# EasyEDA Pro project ProPrj_tang25k_YT8531C_V2.0_2026-08-23.epro, board tang25k
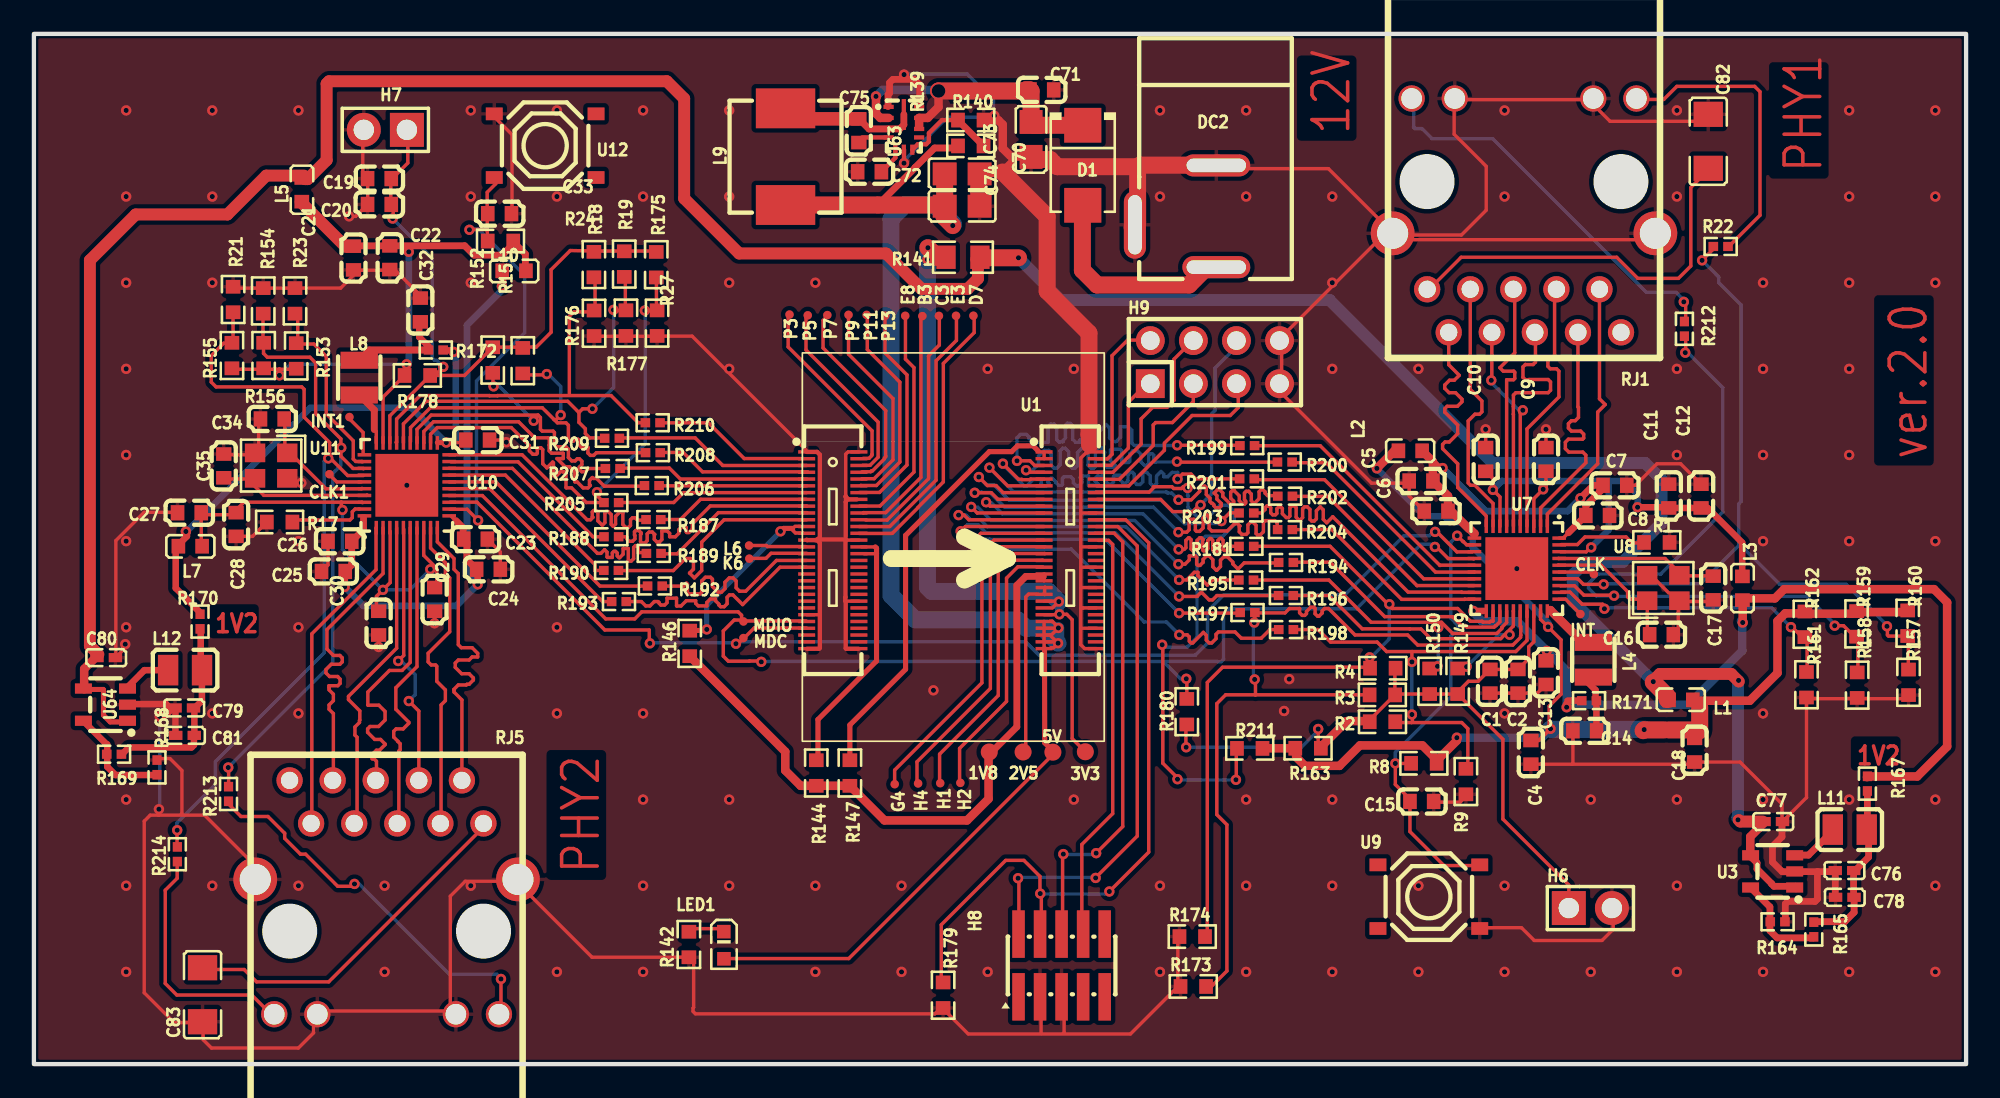
[diagram p8: board, top side]
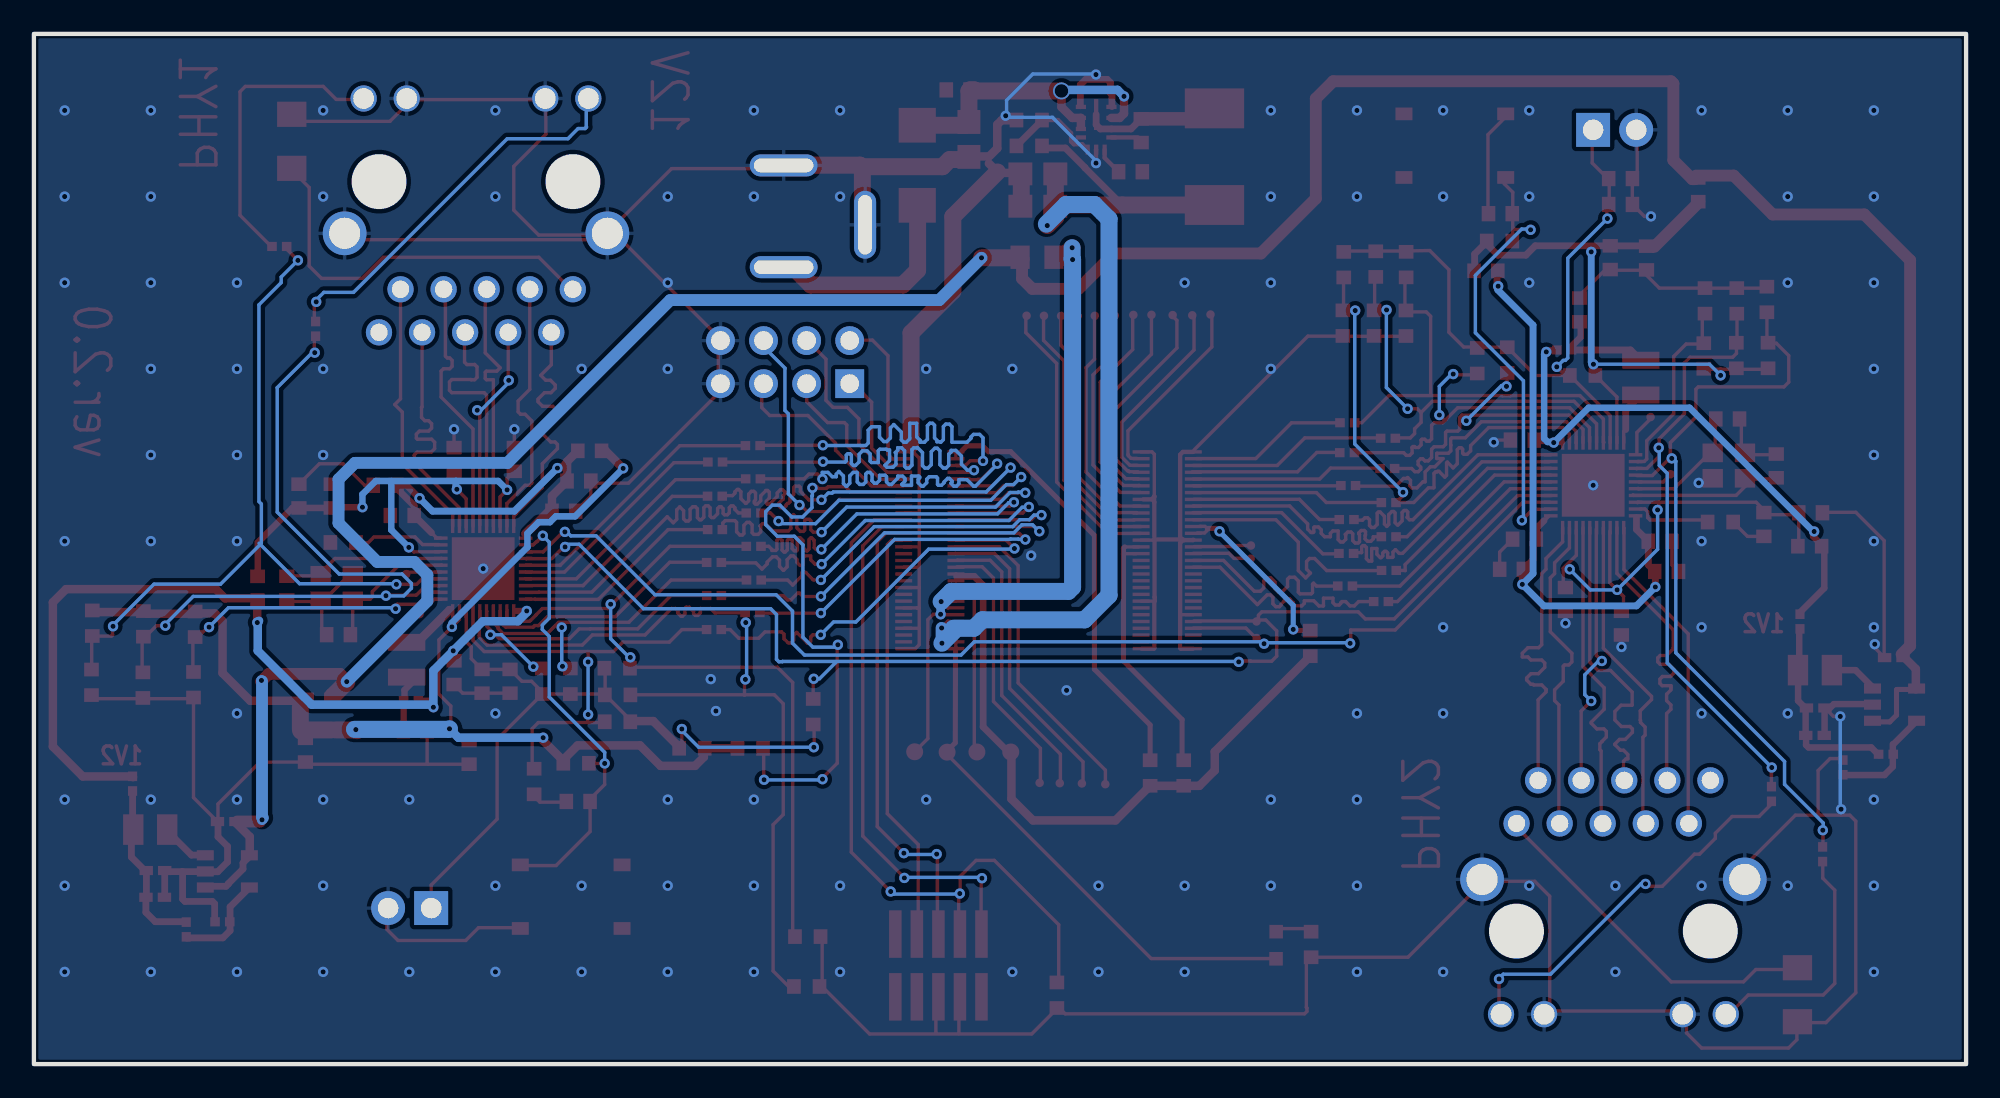
[diagram p9: board, bottom side, seen from below]

Outline 113.93 x 60.75 mm; copper layers: Top Layer, Bottom Layer. Coordinates in mm from the lower left corner of the outline.
Outline path: rectangle 0,60.75 113.93,0
Stack: Top Layer 0.035mm / Dielectric1 1.51mm FR4 er 4.5 / Bottom Layer 0.035mm

## Design rules (mm)
net E1TX0-: DP1
net E1TX0+: DP1
net E2RX3+: DP2
net E2RX3-: DP2
template: Custom Config
spacing copperThickness1oz (default): track to track 0.102, other pairs 0.152 to 0.3
spacing copperThickness2oz: track to track 0.203, other pairs 0.152 to 0.3
track width copperThickness1oz (default): min 0.127, default 0.2, max 2.54
track width copperThickness2oz: min 0.203, default 0.254, max 2.54
differential pair differentialPair (default): width min 0.127, default 0.254, max 2.54; gap min 0.152, default 0.152
via viaSize (default): diameter min 0.5, default 0.61, max 10; hole min 0.3, default 0.305, max 6.3

## Placement (name value [footprint] x y rotation side)
1V8  -  [Test-Point-0.5mm]  56.33 18.4 0 top
2V5  -  [Test-Point-0.5mm]  58.33 18.41 0 top
3V3  -  [Test-Point-0.5mm]  62 18.42 0 top
5V  -  [Test-Point-0.5mm]  60.09 18.39 0 top
B3  -  [Test-Point-0.5mm#2]  52.38 44.11 90 top
C1  1uF  [C0603]  85.86 22.57 90 top
C2  100nF  [C0603]  87.51 22.57 90 top
C3  -  [Test-Point-0.5mm#2]  53.36 44.12 90 top
C4  100nF  [C0603]  88.27 18.38 90 top
C5  1uF  [C0603]  81.79 34.39 0 top
C6  100nF  [C0603]  82.68 32.61 0 top
C7  1uF  [C0603]  93.22 34.13 180 top
C8  100nF  [C0603]  92.21 32.35 180 top
C9  100nF  [C0603]  89.16 35.66 270 top
C10  100nF  [C0603]  85.6 35.66 270 top
C11  100nF  [C0603]  96.4 33.5 270 top
C12  100nF  [C0603]  98.3 33.5 270 top
C13  100nF  [C0603]  89.16 23.08 90 top
C14  10uF  [C0603]  91.45 19.65 180 top
C15  100nF  [C0603]  81.84 15.49 180 top
C16  12pF  [C0603]  95.97 25.32 0 top
C17  12pF  [C0603]  99.02 28.07 270 top
C18  10uF  [C0603]  97.92 18.51 270 top
C19  1uF  [C0603]  20.37 52.22 0 top
C20  100nF  [C0603]  20.37 50.69 0 top
C21  10uF  [C0603]  18.84 47.53 270 top
C22  100nF  [C0603]  20.98 47.55 90 top
C23  1uF  [C0603]  26.04 30.96 180 top
C24  100nF  [C0603]  26.8 29.18 180 top
C25  1uF  [C0603]  17.66 29.05 0 top
C26  100nF  [C0603]  18.04 30.83 0 top
C27  100nF  [C0603]  9.17 32.51 0 top
C28  100nF  [C0603]  11.92 31.82 90 top
C29  100nF  [C0603]  23.63 27.4 90 top
C30  100nF  [C0603]  20.33 26 90 top
C31  100nF  [C0603]  26.17 36.8 180 top
C32  10uF  [C0603]  22.79 44.47 90 top
C33  100nF  [C0603]  27.46 50.15 180 top
C34  12pF  [C0603]  14.06 38.04 180 top
C35  12pF  [C0603]  11.19 35.27 90 top
C70  10uF  [C0805]  58.8 54.53 90 top
C71  220nF  [C0603]  59.43 57.45 0 top
C72  1uF  [C0603]  49.27 52.62 180 top
C73  22uF  [C0805]  54.73 52.49 180 top
C74  22uF  [C0805]  54.73 50.59 180 top
C75  100nF  [C0603]  48.64 55.04 90 top
C76  10uF  [C0402]  106.76 11.41 0 top
C77  4.7uF  [C0402]  102.56 14.3 180 top
C78  6.8pF  [C0402]  106.78 9.84 0 top
C79  10uF  [C0402]  8.87 21 0 top
C80  4.7uF  [C0402]  4.26 23.97 180 top
C81  6.8pF  [C0402]  8.91 19.38 0 top
C82  1nF  [C1206]  98.73 54.42 270 top
C83  1nF  [C1206]  9.94 4.09 90 top
CLK  -  [Test-Point-0.5mm#2]  91.98 28.89 0 top
CLK1  -  [Test-Point-0.5mm#2]  17.42 34.79 0 top
D1  SS56B  [SMB_L4.6-W3.6-LS5.3-RD]  61.85 53 270 top
D7  -  [Test-Point-0.5mm#2]  55.4 44.13 90 top
DC2  DC-005 2.0  [DC-IN-TH_DC-5520-1]  67.32 49.99 270 top
E3  -  [Test-Point-0.5mm#2]  54.37 44.13 90 top
E8  -  [Test-Point-0.5mm#2]  51.38 44.13 90 top
G4  -  [Test-Point-0.5mm#2]  50.76 16.5 0 top
H1  -  [Test-Point-0.5mm#2]  53.44 16.57 0 top
H2  -  [Test-Point-0.5mm#2]  54.63 16.58 0 top
H4  -  [Test-Point-0.5mm#2]  52.14 16.55 0 top
H6  PZ254V-11-02P  [HDR-TH_2P-P2.54-V-M]  91.78 9.2 0 top
H7  PZ254V-11-02P  [HDR-TH_2P-P2.54-V-M]  20.72 55.09 180 top
H8  PZ127VS-12-10-H10-A38  [CONN-SMD_10P-P1.27_XFCN_PZ127VS-12-10-H10-A38]  60.6 5.82 0 top
H9  PZ254V-12-08P-YL  [HDR-TH_8P-P2.54-V-M-R2-C4-S2.54]  69.64 41.4 0 top
INT  -  [Test-Point-0.5mm#2]  91.19 26.54 0 top
INT1  -  [Test-Point-0.5mm#2]  18.6 38.16 0 top
K6  -  [Test-Point-0.5mm#2]  42.19 29.81 0 top
L1  120Ω  [L0603]  97.12 21.48 0 top
L2  120Ω  [L0603]  81.16 36.16 0 top
L3  120Ω  [L0603]  100.74 28.06 270 top
L4  2.2uH  [IND-SMD_L2.5-W2.0_SLW252012P]  91.95 23.84 90 top
L5  120Ω  [L0603]  15.8 51.56 270 top
L6  -  [Test-Point-0.5mm#2]  42.17 30.58 0 top
L7  120Ω  [L0603]  9.22 30.54 180 top
L8  2.2uH  [IND-SMD_L2.5-W2.0_SLW252012P]  19.18 40.48 270 top
L9  1.5uH  [IND-SMD_L7.2-W6.6_GPSR0730]  44.32 53.51 270 top
L10  120Ω  [L0603]  28.31 46.78 180 top
L11  2.2uH  [L0806]  107.07 13.83 0 top
L12  2.2uH  [L0806]  8.91 23.23 0 top
LED1  XL-1608UGC-04  [LED0603-RD_GREEN]  40.68 7.01 270 top
MDC  -  [Test-Point-0.5mm#2]  41.84 25.12 0 top
MDIO  -  [Test-Point-0.5mm#2]  41.84 26.1 0 top
P3  -  [Test-Point-0.5mm#2]  44.55 44.2 0 top
P5  -  [Test-Point-0.5mm#2]  45.63 44.15 0 top
P7  -  [Test-Point-0.5mm#2]  46.78 44.17 0 top
P9  -  [Test-Point-0.5mm#2]  48.03 44.18 0 top
P11  -  [Test-Point-0.5mm#2]  49.1 44.18 90 top
P13  -  [Test-Point-0.5mm#2]  50.2 44.13 0 top
R1  2.49kΩ  [R0603]  95.69 30.76 0 top
R2  10kΩ  [R0603]  79.52 20.19 180 top
R3  10kΩ  [R0603]  79.51 21.77 0 top
R4  10kΩ  [R0603]  79.54 23.34 0 top
R8  4.7kΩ  [R0603]  81.96 17.74 0 top
R9  10kΩ  [R0603]  84.44 16.66 90 top
R17  2.49kΩ  [R0603]  14.49 31.96 180 top
R18  10kΩ  [R0603]  33.02 47.15 90 top
R19  10kΩ  [R0603]  34.81 47.17 90 top
R21  4.7kΩ  [R0603]  11.75 45.09 90 top
R22  330Ω  [R0402]  99.46 48.21 180 top
R23  4.7kΩ  [R0603]  15.39 45.01 90 top
R24  4.7kΩ  [R0603]  27.51 48.53 0 top
R27  10kΩ  [R0603]  36.75 43.69 90 top
R139  100kΩ  [R0603]  55.24 54.15 180 top
R140  24.9kΩ  [R0603]  55.24 55.67 180 top
R141  0Ω  [R0805]  54.78 47.58 0 top
R142  470Ω  [R0603]  38.62 7.05 90 top
R144  0Ω  [R0603]  46.13 17.16 270 top
R146  0Ω  [R0603]  38.67 24.81 90 top
R147  0Ω  [R0603]  48.11 17.16 90 top
R149  4.7kΩ_NO  [R0603]  83.95 22.57 90 top
R150  4.7kΩ_N0  [R0603]  82.3 22.57 90 top
R151  4.7kΩ_NO  [R0603]  28.83 41.48 270 top
R152  4.7kΩ_N0  [R0603]  27.05 41.52 270 top
R153  4.7kΩ  [R0603]  15.47 41.76 90 top
R154  4.7kΩ  [R0603]  13.52 45 90 top
R155  4.7kΩ  [R0603]  11.68 41.78 90 top
R156  4.7kΩ  [R0603]  13.55 41.78 90 top
R157  4.7kΩ  [R0603]  110.54 22.51 270 top
R158  4.7kΩ  [R0603]  107.51 22.35 270 top
R159  4.7kΩ  [R0603]  107.48 25.96 270 top
R160  4.7kΩ  [R0603]  110.49 26 270 top
R161  4.7kΩ  [R0603]  104.52 22.37 270 top
R162  4.7kΩ  [R0603]  104.42 25.93 270 top
R163  4.7kΩ  [R0603]  75.13 18.62 180 top
R164  100kΩ  [R0402]  102.82 8.39 180 top
R165  100kΩ  [R0402]  104.95 7.94 90 top
R167  0Ω  [R0402]  108.11 16.54 90 top
R168  100kΩ  [R0402]  7.26 17.5 270 top
R169  100kΩ  [R0402]  4.73 18.27 0 top
R170  0Ω  [R0402]  9.8 26.1 90 top
R171  0Ω_DNP  [R0402]  91.7 21.43 0 top
R172  0Ω_DNP  [R0402]  23.7 42.11 180 top
R173  10kΩ  [R0603]  68.36 4.58 0 top
R174  10kΩ  [R0603]  68.3 7.52 0 top
R175  10kΩ  [R0603]  36.7 47.14 90 top
R176  10kΩ  [R0603]  33.03 43.69 90 top
R177  10kΩ  [R0603]  34.91 43.69 90 top
R178  4.7kΩ  [R0603]  22.61 40.61 180 top
R179  5.1kΩ  [R0603]  53.61 4.06 270 top
R180  1.5kΩ  [R0603]  67.98 20.78 90 top
R181  22Ω  [R0402]  71.49 30.53 180 top
R187  22Ω  [R0402]  36.53 32.11 0 top
R188  22Ω  [R0402]  34.05 31.1 0 top
R189  22Ω  [R0402]  36.55 30.11 0 top
R190  22Ω  [R0402]  34.03 29.11 0 top
R192  22Ω  [R0402]  36.62 28.19 0 top
R193  22Ω  [R0402]  34.5 27.27 0 top
R194  22Ω  [R0402]  73.83 29.58 180 top
R195  22Ω  [R0402]  71.48 28.54 180 top
R196  22Ω  [R0402]  73.83 27.63 180 top
R197  22Ω  [R0402]  71.56 26.63 180 top
R198  22Ω  [R0402]  73.83 25.62 180 top
R199  0Ω  [R0402]  71.54 36.47 180 top
R200  0Ω  [R0402]  73.76 35.5 180 top
R201  0Ω  [R0402]  71.53 34.51 180 top
R202  0Ω  [R0402]  73.78 33.49 180 top
R203  0Ω  [R0402]  71.5 32.5 180 top
R204  0Ω  [R0402]  73.77 31.52 180 top
R205  0Ω  [R0402]  34.05 33.11 0 top
R206  0Ω  [R0402]  36.43 34.12 0 top
R207  0Ω  [R0402]  34.13 35.12 0 top
R208  0Ω  [R0402]  36.5 36.05 0 top
R209  0Ω  [R0402]  34.09 36.91 0 top
R210  0Ω  [R0402]  36.49 37.82 0 top
R211  10kΩ  [R0603]  71.69 18.62 0 top
R212  330Ω  [R0402]  97.32 43.36 270 top
R213  330Ω  [R0402]  11.47 15.93 90 top
R214  330Ω  [R0402]  8.46 12.37 90 top
RJ1  HY911130A  [RJ45-TH_10P-P2.54-S2.54_L16.1-W21.4_HY911130A]  87.86 50.05 180 top
RJ5  HY911130A  [RJ45-TH_10P-P2.54-S2.54_L16.1-W21.4_HY911130A]  20.8 9.84 0 top
U1  -  [tang25k_som]  59.44 37.54 270 top
U3  TLV62569DBVR  [SOT-23-5_L3.0-W1.7-P0.95-LS2.8-BR]  102.53 11.36 0 top
U7  YT8531C  [QFN-40_L5.0-W5.0-P0.40-BL-EP3.7]  87.44 29.22 180 top
U8  25MHz  [CRYSTAL-SMD_4P-L2.5-W2.0-BL]  96.08 28.07 0 top
U9  TS-1187A-B-A-B  [SW-SMD_4P-L5.1-W5.1-P3.70-LS6.5-TL_H1.5]  82.25 9.87 0 top
U10  YT8531C  [QFN-40_L5.0-W5.0-P0.40-BL-EP3.7]  21.99 34.13 0 top
U11  25MHz  [CRYSTAL-SMD_4P-L2.5-W2.0-BL]  13.99 35.29 180 top
U12  TS-1187A-B-A-B  [SW-SMD_4P-L5.1-W5.1-P3.70-LS6.5-TL_H1.5]  30.15 54.16 180 top
U63  LMR33630CQRNXTQ1  [VQFN-12_L3.0-W2.0-P0.65-BL_TI_RNX]  51.3 55.18 270 top
U64  TLV62569DBVR  [SOT-23-5_L3.0-W1.7-P0.95-LS2.8-BR]  4.22 21.2 0 top

## Footprints (pads in the part's own frame, mm; a bottom-side part is the same pattern mirrored in y, then rotated)
C0402
  rect 0.79x0.54 smd: 1(-0.545,0) 2(0.545,0)
C0603
  rect 0.8x0.9 smd: 1(-0.7,0) 2(0.7,0)
C0805
  rect 1.41x1.35 smd: 1(-1.03,0) 2(1.03,0)
C1206
  rect 1.485x1.728 smd: 1(-1.593,0) 2(1.593,0)
CONN-SMD_10P-P1.27_XFCN_PZ127VS-12-10-H10-A38
  rect 0.74x2.8 smd: 1(-2.54,-1.85) 2(-2.54,1.85) 3(-1.27,-1.85) 4(-1.27,1.85) 5(0,-1.85) 6(0,1.85) 7(1.27,-1.85) 8(1.27,1.85) 9(2.54,-1.85) 10(2.54,1.85)
CRYSTAL-SMD_4P-L2.5-W2.0-BL
  rect 1.2x1.1 smd: 1(-0.95,-0.75) 2(0.95,-0.75) 3(0.95,0.75) 4(-0.95,0.75)
DC-IN-TH_DC-5520-1
  oval 4x1.3 hole 3.5x0.8: 2(0.5,-2.4)
  oval 1.3x4 hole 0.8x3.5: 3(-3,2.4) 4(3,2.4)
HDR-TH_2P-P2.54-V-M
  rect 2x2 hole 1.2: 1(-1.27,0)
  round 2 hole 1.2: 2(1.27,0)
HDR-TH_8P-P2.54-V-M-R2-C4-S2.54
  rect 1.7x1.7 hole 1.1: 1(-3.81,-1.27)
  round 1.7 hole 1.1: 2(-3.81,1.27) 3(-1.27,-1.27) 4(-1.27,1.27) 5(1.27,-1.27) 6(1.27,1.27) 7(3.81,-1.27) 8(3.81,1.27)
IND-SMD_L2.5-W2.0_SLW252012P
  rect 1x2.2 smd: 1(-1.025,0) 2(1.025,0)
IND-SMD_L7.2-W6.6_GPSR0730
  rect 2.35x3.5 smd: 1(-2.85,0) 2(2.85,0)
L0603
  rect 0.8x0.864 smd: 1(-0.7,0) 2(0.7,0)
L0806
  rect 1.2x1.8 smd: 1(-1,0) 2(1,0)
LED0603-RD_GREEN
  rect 0.8x0.8 smd: 1(-0.799,-0.004) 2(0.799,0.004)
QFN-40_L5.0-W5.0-P0.40-BL-EP3.7
  rect 0.2x0.8 smd: 1(-1.8,-2.499) 2(-1.4,-2.499) 3(-1,-2.499) 4(-0.6,-2.499) 5(-0.2,-2.499) 6(0.2,-2.499) 7(0.6,-2.499) 8(1,-2.499) 9(1.4,-2.499) 10(1.8,-2.499) 21(1.8,2.499) 22(1.4,2.499) 23(1,2.499) 24(0.6,2.499) 25(0.2,2.499) 26(-0.2,2.499) 27(-0.6,2.499) 28(-1,2.499) 29(-1.4,2.499) 30(-1.8,2.499)
  rect 0.8x0.2 smd: 11(2.499,-1.8) 12(2.499,-1.4) 13(2.499,-1) 14(2.499,-0.6) 15(2.499,-0.2) 16(2.499,0.2) 17(2.499,0.6) 18(2.499,1) 19(2.499,1.4) 20(2.499,1.8) 31(-2.499,1.8) 32(-2.499,1.4) 33(-2.499,1) 34(-2.499,0.6) 35(-2.499,0.2) 36(-2.499,-0.2) 37(-2.499,-0.6) 38(-2.499,-1) 39(-2.499,-1.4) 40(-2.499,-1.8)
  rect 3.7x3.7 smd: 41(0,0)
R0402
  rect 0.566x0.54 smd: 1(-0.433,0) 2(0.433,0)
R0603
  rect 0.806x0.864 smd: 1(-0.753,0) 2(0.753,0)
R0805
  rect 1.133x1.377 smd: 1(-1,0) 2(1,0)
RJ45-TH_10P-P2.54-S2.54_L16.1-W21.4_HY911130A
  round 1.55 hole 1.016: 1(-5.72,6.895) 2(-4.45,4.355) 3(-3.18,6.895) 4(-1.91,4.355) 5(-0.64,6.895) 6(0.63,4.355) 7(1.9,6.895) 8(3.17,4.355) 9(4.44,6.895) 10(5.71,4.355)
  round 1.55 hole 1.219: 11(-6.625,-6.895) 12(-4.085,-6.895) 13(4.085,-6.895) 14(6.625,-6.895)
  round 2.58 hole 1.829: 15(-7.745,1.055) 16(7.745,1.055)
SMB_L4.6-W3.6-LS5.3-RD
  rect 2.047x2.192 smd: 1(-2.361,0) 2(2.361,0)
SOT-23-5_L3.0-W1.7-P0.95-LS2.8-BR
  rect 1x0.6 smd: 1(1.3,-0.95) 2(1.3,0) 3(1.3,0.95) 4(-1.3,0.95) 5(-1.3,-0.95)
SW-SMD_4P-L5.1-W5.1-P3.70-LS6.5-TL_H1.5
  rect 1x0.75 smd: 1(-3,1.875) 2(3,1.875) 3(-3,-1.875) 4(3,-1.875)
tang25k_som
  rect 0.2x1 smd: J1P1(1.439,-10.796) J1P2(1.439,-13.876) J1P3(1.839,-10.796) J1P4(1.839,-13.876) J1P5(2.239,-10.796) J1P6(2.239,-13.876) J1P7(2.639,-10.796) J1P8(2.639,-13.876) J1P9(3.039,-10.796) J1P10(3.039,-13.876) J1P11(3.439,-10.796) J1P12(3.439,-13.876) J1P13(3.839,-10.796) J1P14(3.839,-13.876) J1P15(4.239,-10.796) J1P16(4.239,-13.876) J1P17(4.639,-10.796) J1P18(4.639,-13.876) J1P19(5.039,-10.796) J1P20(5.039,-13.876) J1P21(5.439,-10.796) J1P22(5.439,-13.876) J1P23(5.839,-10.796) J1P24(5.839,-13.876) J1P25(6.239,-10.796) J1P26(6.239,-13.876) J1P27(6.639,-10.796) J1P28(6.639,-13.876) J1P29(7.039,-10.796) J1P30(7.039,-13.876) J1P31(7.439,-10.796) J1P32(7.439,-13.876) J1P33(7.839,-10.796) J1P34(7.839,-13.876) J1P35(8.239,-10.796) J1P36(8.239,-13.876) J1P37(8.639,-10.796) J1P38(8.639,-13.876) J1P39(9.039,-10.796) J1P40(9.039,-13.876) J1P41(9.439,-10.796) J1P42(9.439,-13.876) J1P43(9.839,-10.796) J1P44(9.839,-13.876) J1P45(10.239,-10.796) J1P46(10.239,-13.876) J1P47(10.639,-10.796) J1P48(10.639,-13.876) J1P49(11.039,-10.796) J1P50(11.039,-13.876) J1P51(11.439,-10.796) J1P52(11.439,-13.876) J1P53(11.839,-10.796) J1P54(11.839,-13.876) J1P55(12.239,-10.796) J1P56(12.239,-13.876) J1P57(12.639,-10.796) J1P58(12.639,-13.876) J1P59(13.039,-10.796) J1P60(13.039,-13.876) J2P1(1.439,3.204) J2P2(1.439,0.124) J2P3(1.839,3.204) J2P4(1.839,0.124) J2P5(2.239,3.204) J2P6(2.239,0.124) J2P7(2.639,3.204) J2P8(2.639,0.124) J2P9(3.039,3.204) J2P10(3.039,0.124) J2P11(3.439,3.204) J2P12(3.439,0.124) J2P13(3.839,3.204) J2P14(3.839,0.124) J2P15(4.239,3.204) J2P16(4.239,0.124) J2P17(4.639,3.204) J2P18(4.639,0.124) J2P19(5.039,3.204) J2P20(5.039,0.124) J2P21(5.439,3.204) J2P22(5.439,0.124) J2P23(5.839,3.204) J2P24(5.839,0.124) J2P25(6.239,3.204) J2P26(6.239,0.124) J2P27(6.639,3.204) J2P28(6.639,0.124) J2P29(7.039,3.204) J2P30(7.039,0.124) J2P31(7.439,3.204) J2P32(7.439,0.124) J2P33(7.839,3.204) J2P34(7.839,0.124) J2P35(8.239,3.204) J2P36(8.239,0.124) J2P37(8.639,3.204) J2P38(8.639,0.124) J2P39(9.039,3.204) J2P40(9.039,0.124) J2P41(9.439,3.204) J2P42(9.439,0.124) J2P43(9.839,3.204) J2P44(9.839,0.124) J2P45(10.239,3.204) J2P46(10.239,0.124) J2P47(10.639,3.204) J2P48(10.639,0.124) J2P49(11.039,3.204) J2P50(11.039,0.124) J2P51(11.439,3.204) J2P52(11.439,0.124) J2P53(11.839,3.204) J2P54(11.839,0.124) J2P55(12.239,3.204) J2P56(12.239,0.124) J2P57(12.639,3.204) J2P58(12.639,0.124) J2P59(13.039,3.204) J2P60(13.039,0.124)
Test-Point-0.5mm
  round 1 smd: 1(0,0)
Test-Point-0.5mm#2
  round 0.5 smd: 1(0,0)
VQFN-12_L3.0-W2.0-P0.65-BL_TI_RNX
  rect 0.25x0.6 smd: 1(-1.262,-0.9) 2(-0.613,-0.9) 3(0.037,-0.9) 4(0.537,-0.9) 8(0.537,0.9) 9(0.037,0.9) 10(-0.613,0.9) 11(-1.262,0.9)
  rect 0.6x0.25 smd: 5(1.262,-0.5) 6(1.262,0) 7(1.262,0.5)
  rect 1.825x0.25 smd: 12(-0.812,0)

## Nets
As in the schematic, except:
GND: C1.1 C2.1 C4.1 C5.1 C6.1 C7.1 C8.1 C9.1 C10.1 C11.1 C12.1 C13.1 C14.2 C15.1 C16.2 C17.2 C18.2 C19.1 C20.1 C21.2 C22.1 C23.1 C24.1 C25.1 C26.1 C27.1 C28.1 C29.1 C30.1 C31.1 C32.2 C33.1 C34.2 C35.2 C70.1 C71.2 C72.2 C73.1 C74.1 C76.1 C77.1 C78.1 C79.1 C80.1 C81.1 C82.1 C83.1 DC2.2 DC2.3 H6.2 H7.2 H8.3 H8.5 H9.7 H9.8 R1.2 R9.1 R17.2 R21.2 R23.2 R27.1 R140.1 R142.1 R154.2 R157.2 R158.2 R161.2 R164.1 R168.1 R173.1 R174.1 R176.1 R177.1 R179.2 RJ1.12 RJ1.13 RJ1.15 RJ1.16 RJ5.12 RJ5.13 RJ5.15 RJ5.16 U1.J1P1 U1.J1P2 U1.J1P15 U1.J1P27 U1.J1P28 U1.J1P45 U1.J1P50 U1.J1P59 U1.J1P60 U1.J2P1 U1.J2P19 U1.J2P29 U1.J2P35 U1.J2P41 U1.J2P47 U1.J2P53 U1.J2P59 U3.2 U7.41 U8.2 U8.4 U9.4 U10.41 U11.2 U11.4 U12.4 U63.1 U63.6 U63.11 U64.2
VCC5: 5V.1 C73.2 C74.2 L9.2 LED1.2 R139.2 U1.J2P52 U1.J2P54 U1.J2P56 U1.J2P58 U1.J2P60
VCC12: C70.2 C71.1 D1.1 U63.2 U63.9 U63.10
VDD_1V8: 1V8.1 R144.2 R146.1 R147.1 U1.J2P38 U1.J2P40
VDD_2V5: 2V5.1 U1.J2P42 U1.J2P44
VDD_3V3: 3V3.1 R141.1 U1.J2P46 U1.J2P48 U1.J2P50
$2I6377\$1N450: C72.1 U63.5
$2I6377\$1N552: D1.2 DC2.4
$2I6377\BOOT: C75.1 U63.4
$2I6377\FEEDBACK: R139.1 R140.2 U63.7
$2I6377\SW: C75.2 L9.1 U63.3 U63.12
$2N8592: R147.2 U1.J2P2 U1.J2P4

Pads without a net: H8 1 7 9 10; RJ1 1; RJ5 1; U1 J1P33 J1P35 J1P37 J1P38 J1P39 J1P40 J1P41 J1P42 J1P43 J1P44 J1P46 J1P47 J1P48 J1P49 J1P51 J1P53 J1P55 J1P56 J1P57 J1P58 J2P17 J2P31 J2P33 J2P37 J2P39 J2P43 J2P45 J2P49 J2P51 J2P55 J2P57; U9 1 3; U12 1 3; U63 8

## Via types
v1: diameter 0.61, hole 0.305, Top Layer to Bottom Layer, 252 vias
v2: diameter 1, hole 0.8, Top Layer to Bottom Layer, 1 via

## Routing (per net, layer and track width the routed paths; a pad name or vN(x,y) marks a point on that pad's centre or on a via; arc(x,y) is an arc through that point)
AVDD33: length 22.5
  Top Layer w0.2: 90.49,31.34 90.17,31.02 U7.40 ; 84.6,31.57 84.65,31.57
  Top Layer w0.4: v1(83.06,35.15) 82.87,35.15 82.49,35.53 ; v1(91.19,33.37) 91.95,34.13 C7.2 92.52,33.94 91.51,32.92 C8.2 90.49,31.34
  Top Layer w0.5: L2.2 82.49,35.53 C5.2 83.38,33.5 C6.2 83.57,32.61 84.6,31.57 ; 84.65,31.57 84.93,31.29 84.94,31.29
  Bottom Layer w0.4: v1(91.19,33.37) 90.43,32.61 85.6,32.61 v1(83.06,35.15)
AVDDL: length 29.9
  Top Layer w0.2: 9.87,32.4 9.84,32.4 9.81,32.43 ; 9.87,32.4 11.75,32.4 ; 9.87,32.4 9.87,30.54 9.96,30.44 ; 21.01,31.42 21.01,28.39 v1(20.58,27.96) 20.2,27.58 20.2,26.7 ; 23.75,28.1 23.75,29.23 22.98,30 22.98,31.46 ; 19.38,33.1 19.35,33.13 18.12,33.13 ; 11.92,32.64 11.92,32.67 12.38,33.13 18.12,33.13 ; 18.12,33.13 18.12,32.62 18.17,32.58 ; 18.12,33.13 18.12,33.15
  Bottom Layer w0.2: 18.19,32.66 18.19,30.35 v1(20.58,27.96) 22.16,27.96 v1(23.37,29.18)
  vias: v1(18.19,32.68)
DVDD33: length 71.8
  Top Layer w0.2: C4.2 88.74,19.08 v1(89.43,19.77) 89.35,19.85 89.35,21.11 90.05,21.81 90.05,25.02 v1(89.28,25.78) 88.84,26.23 U7.29 ; 97.67,21.42 97.84,21.42
  Top Layer w0.5: 82.73,17.93 81.87,18.79 78.19,18.79 76.98,17.59 74.95,17.59 74.43,18.1 74.43,18.51 ; 107.45,26.8 107.22,26.56 104.59,26.56 ; 82.62,17.79 83.9,19.08 v1(83.9,19.25) ; L2.1 80.22,36.16 v1(79.19,35.13) ; 104.48,26.58 103.26,26.58 102.81,26.12 102.81,23.06 101.18,21.42 97.84,21.42 98.22,21.04 ; 110.33,26.67 110.32,26.66 107.58,26.66 ; 74.28,18.62 72.46,18.62
  Top Layer w1: 96.14,19.71 94.93,19.71 94.89,19.66 ; 98.19,19.64 98.13,19.71 96.41,19.71 ; 98.22,21.04 98.22,19.77
  Bottom Layer w0.381: 89.3,25.76 89.3,26.02 84.83,30.48 84.83,31.3 84.17,31.96 83.51,31.96 83.16,32.3 82.01,32.3 v1(79.19,35.13)
  Bottom Layer w0.5: v1(89.43,19.77) 88.9,19.25 v1(83.9,19.25)
  Bottom Layer w1: v1(89.43,19.77) 89.46,19.74 95.03,19.74
  vias: v1(94.95,19.72)
DVDD_RGMII: length 44.8
  Top Layer w0.2: 67.93,18.7 67.93,19.94 67.91,19.96 ; 80.25,21.81 80.25,23.3 80.23,23.31 ; H6.1 90.51,10.56 86.62,14.45 86.62,19.15 R149.1 ; 75.73,19.74 75.73,18.75 75.84,18.63 ; 80.23,21.75 78.84,20.37 ; R149.1 R150.1 80.32,21.82 R3.2 ; R149.1 83.95,21.94 84.59,22.57 85.16,22.57 C1.2 C2.2 88.14,23.91 88.14,24.61 88.44,24.9 U7.28
  Top Layer w0.5: 78.81,20.23 77.41,20.23 75.89,18.71
  Bottom Layer w0.2: v1(67.94,18.68) 74.73,18.68 75.74,19.69
  vias: v1(75.73,19.76)
DVDDL: length 52.6
  Top Layer w0.2: 90.36,21.02 90.36,21.22 90.29,21.29 90.43,21.43
  Top Layer w0.381: R171.1 90.43,21.43 ; v1(84.87,26.72) 85.48,26.72
  Top Layer w0.5: v1(100.76,26.04) 100.76,27.27 100.72,27.31 ; 100.73,27.33 100.86,27.46 102.66,27.46 103.2,28 112.04,28 112.81,27.23 112.81,18.72 111.05,16.96 108.13,16.96 108.09,16.92
  Bottom Layer w0.5: 100.66,26.14 100.73,26.07 100.73,24.38 97.55,21.19 90.53,21.19 v1(90.38,21.04) 90.38,23.2 v1(89.21,24.37) 87.46,26.12 85.39,26.12 84.83,26.68
GND: length 447.2
  Top Layer w0.2: 61.73,25.67 61.73,24.73 61.96,24.5 U1.J2P59 ; 61.73,25.67 61.75,25.7 U1.J2P53 ; 61.73,25.67 61.73,26.89 ; 67.54,4.65 67.58,4.61 67.58,4.64 ; 60.71,1.83 60.75,1.86 60.75,4 ; 18.9,46.81 20.84,46.81 ; 4.83,23.99 4.83,30.87 6.5,32.54 8.29,32.54 ; 4.83,23.99 C80.1 ; 4.83,23.99 5.39,24.55 v1(5.39,24.76) ; U1.J2P35 61.74,29.3 61.73,29.29 ; R161.2 104.52,15.71 C77.1 103.08,14.33 103.08,15.33 100.6,17.81 C18.2 97.8,17.68 90.69,17.68 ; 80.07,48.61 95.23,48.61 95.56,48.94 ; 79.76,48.7 79.39,48.7 73.37,42.68 ; C29.1 23.63,26 v1(23.62,25.99) ; 83.79,56.88 91.85,56.88 91.97,57 ; v1(85.6,37.43) C10.1 ; R23.2 18.09,45.76 18.9,46.58 18.9,46.78 C21.2 ; v1(7.42,20.5) 7.82,20.5 C79.1 ; 67.45,7.48 67.45,4.74 ; 12.86,35.87 13.25,36.26 13.25,38 ; 80.18,48.95 76.33,52.8 69.82,52.8 ; 16.96,29.05 17.34,29.43 C26.1 ; 13.03,11.06 13.03,11.72 10.06,14.68 7.36,14.68 ; 16.49,2.71 16.49,1.84 15.59,0.95 10.47,0.95 9.98,1.44 9.98,2.43 ; 19.68,52.22 19.68,52.19 ; 19.68,52.19 19.8,52.07 ; 19.68,52.19 19.68,50.77 ; 27.82,36.67 27.69,36.8 C31.1 ; C30.1 20.33,24.6 v1(20.32,24.6) ; C6.1 81.09,33.5 C5.1 80.97,34.26 78.87,34.26 73.45,39.68 H9.7 ; 61.73,28.08 61.75,28.1 U1.J2P41 ; 61.73,28.08 61.73,29.29 ; 61.73,28.08 61.73,26.89 ; 96.96,27.28 96.96,27.29 ; 96.96,27.28 98.94,27.28 98.99,27.33 ; 96.96,27.28 96.94,27.28 ; 96.96,27.28 96.96,25.6 96.64,25.29 ; 47.87,35.96 47.87,33.48 ; C23.1 27.5,30.19 C24.1 ; U1.J1P50 46.32,26.5 46.34,26.53 ; 107.68,21.55 110.64,21.55 110.72,21.63 ; 107.68,21.55 107.69,21.56 ; 107.68,21.55 104.67,21.55 ; U8.4 95.36,28.82 96.4,27.78 ; 62.36,36.29 62.12,36.05 62.04,36.05 61.73,35.74 61.73,32.5 ; 83.75,56.82 83.75,54.83 85.63,52.94 85.63,50.35 84.17,48.89 79.84,48.89 ; 73.57,40.21 73.57,42.78 ; 36.91,42.93 38.81,42.93 45.51,36.23 ; 89.16,22.38 88.65,21.87 C2.1 C1.1 ; 24.55,3.27 24.55,9.9 25.43,10.78 27.9,10.78 ; 73.39,40.21 73.45,40.21 ; 90.69,17.68 90.75,17.74 C14.2 ; 90.69,17.68 C4.1 ; 59.39,3.9 59.39,1.81 59.4,1.79 ; R17.2 12.89,31.12 C28.1 ; 61.73,29.29 61.73,30.48 ; 11.14,35.93 12.8,35.93 ; 61.73,30.48 61.73,32.5 ; 61.73,30.48 61.75,30.5 U1.J2P29 ; 28.57,10.64 32.91,6.3 38.51,6.3 ; 19.66,52.21 19.39,52.48 19.39,55.1 ; 61.73,26.89 61.85,26.89 61.86,26.9 U1.J2P47 ; 27.13,55.88 28.19,54.81 28.19,50.12 ; 96.4,30.79 96.39,30.78 ; 22.84,45.27 21.31,46.81 21,46.81 ; 53.7,3.17 55.09,1.78 64.66,1.78 67.49,4.61 ; 47.87,27.29 47.88,27.3 U1.J1P45 ; 19.72,50.74 19.82,50.64 ; 7.36,14.68 7.37,14.69 v1(7.37,15.03) ; 7.36,14.68 6.86,14.68 6.5,14.33 6.5,4.21 8.27,2.44 9.71,2.44 ; 47.86,35.96 48,36.1 U1.J1P1 ; 84.41,15.76 84.1,15.44 82.58,15.44 ; 61.73,32.5 61.73,32.5 U1.J2P19 ; 8.68,14.73 8.72,14.77 8.72,17.31 8.02,18.02 7.34,18.02 ; C7.1 94.43,34.13 95.7,35.4 97.1,35.4 C12.1 ; 16.8,3.13 24.48,3.13 24.66,2.95 ; 11.71,45.75 15.31,45.75 15.35,45.72 ; 36.72,43.11 36.53,42.92 33.02,42.92 ; C20.1 18.97,49.99 v1(18.58,49.99) ; U1.J1P27 47.89,30.9 ; 38.9,6.27 38.9,3.34 38.87,3.31 38.87,3.11 39.01,2.96 53.12,2.96 53.36,3.21 ; 91.9,56.93 91.9,56.63 92.94,55.59 98.16,55.59 98.45,55.89 ; 85.32,8.04 87.71,8.04 88.47,7.29 92.46,7.29 93.12,7.95 93.12,9.1 ; 96.43,31.01 96.43,30.75 ; C9.1 v1(89.16,37.43)
  Top Layer w0.254: 47.88,33.45 48.03,33.3 48.52,33.3 ; 47.88,33.45 47.87,33.46 47.87,33.48 47.88,33.45 ; 47.88,33.45 47.88,33.15 47.87,33.14 47.87,31.11 ; 45.59,24.49 46.3,24.49 46.34,24.54 46.34,30.74 46.18,30.9 ; 45.57,30.92 45.59,30.9 46.09,30.9 ; 46.09,30.9 46.18,30.9 ; 46.09,30.9 46.22,30.94 ; 46.18,30.9 46.22,30.94 ; U63.6 51.31,53.91 v1(51.31,53.13) ; 46.22,30.94 47.88,30.94 47.88,30.92 ; 46.22,30.94 46.34,31.06 46.34,35.94 46.18,36.1 45.59,36.1 45.57,36.12 ; 47.88,30.92 47.85,30.89 47.85,27.53 47.84,27.52 47.84,27.31 47.87,27.29 47.87,24.52 47.9,24.49 48.62,24.49 ; 47.88,30.92 47.9,30.89 ; 96.39,31.05 96.43,31.01
  Top Layer w0.381: 5.51,21.23 5.89,21.23 5.9,21.23 7.8,21.23 8.05,20.97 ; 8.34,20.9 8.34,19.48
  Top Layer w0.4: 105.18,11.35 105.16,11.33 105.16,9.73 105.02,9.59 103.41,9.59 103.27,9.45 103.27,8.37 ; 105.18,11.35 106.04,11.35 106.14,11.44 ; 105.18,11.35 103.85,11.35 ; 103.82,11.34 103.09,11.34 102.51,11.92 102.51,12.84 103.08,13.4 103.08,14.23 ; 50.36,56.47 50.36,57.17 50.45,57.26 50.45,57.88 50.64,58.07 51.91,58.07 52.23,57.75 52.23,56.51 ; 106.21,9.84 106.22,9.84 106.22,11.41
  Top Layer w0.5: 57.62,53.52 58.7,53.52 ; 57.56,53.57 57.13,54 57.13,55.4 56.87,55.66 56.04,55.66 ; 57.12,52.61 57.62,53.11 ; 55.77,52.55 57,52.55
  Top Layer w1: 69.75,53.14 69.62,53.01 65.22,53.01 65.13,52.92 ; 65.13,52.92 65.08,52.87 65.08,49.66 64.76,49.34 ; 65.13,52.92 60.35,52.92 59.93,53.34 58.81,53.34 ; 55.71,50.63 55.71,52.52 ; 57.12,52.61 59.75,49.98 59.75,45.58 62.21,43.11 62.21,37.1 62.24,37.07 62.24,36.52
  Bottom Layer w0.2: 56.72,55.83 53.87,55.83 51.17,53.14 ; 51.31,58.38 55.03,58.38 56.58,56.84 56.58,56.09 56.62,56.04 ; v1(7.37,15.03) 7.42,15.08 v1(7.42,20.5)
  vias: v1(5.44,56.24) v1(5.44,51.16) v1(5.44,46.08) v1(5.44,41) v1(5.44,35.92) v1(5.44,30.84) v1(5.44,25.76) v1(5.44,15.6) v1(5.44,10.52) v1(5.44,5.44) v1(10.52,56.24) v1(10.52,51.16) v1(10.52,46.08) v1(10.52,20.68) v1(10.52,10.52) v1(15.6,56.24) v1(15.6,30.84) v1(15.6,25.76) v1(15.6,20.68) v1(15.6,10.52) v1(15.77,34.27) v1(20.68,10.52) v1(20.68,5.44) v1(21.99,34.13) v1(25.76,56.24) v1(25.76,51.16) v1(25.76,46.08) v1(25.76,10.52) v1(27.85,36.67) v1(30.84,56.24) v1(30.84,51.16) v1(30.84,25.76) v1(30.84,20.68) v1(30.84,5.44) v1(35.92,56.24) v1(35.92,51.16) v1(35.92,20.68) v1(35.92,15.6) v1(35.92,10.52) v1(35.92,5.44) v1(41,56.24) v1(41,51.16) v1(41,46.08) v1(41,41) v1(41,15.6) v1(41,10.52) v1(46.08,46.08) v1(46.08,10.52) v1(46.08,5.44) v1(51.16,10.52) v1(51.16,5.44) v1(51.31,58.35) v1(53.04,22.04) v1(55.13,29.99) v1(56.24,41) v1(56.24,5.44) v1(56.63,55.92) v1(61.32,41) v1(61.32,15.6) v1(66.4,56.24) v1(66.4,51.16) v1(66.4,10.52) v1(66.4,5.44) v1(71.48,56.24) v1(71.48,51.16) v1(71.48,15.6) v1(71.48,10.52) v1(71.48,5.44) v1(73.72,20.82) v1(74.02,22.7) v1(76.56,51.16) v1(76.56,46.08) v1(76.56,41) v1(76.56,15.6) v1(76.56,10.52) v1(76.56,5.44) v1(81.64,41) v1(81.64,10.52) v1(81.64,5.44) v1(86.72,56.24) v1(86.72,51.16) v1(86.72,20.68) v1(86.72,10.52) v1(86.72,5.44) v1(87.44,29.22) v1(91.8,15.6) v1(91.8,5.44) v1(96.88,56.24) v1(96.88,51.16) v1(96.88,41) v1(96.88,35.92) v1(96.88,15.6) v1(96.88,10.52) v1(96.88,5.44) v1(101.96,46.08) v1(101.96,41) v1(101.96,35.92) v1(101.96,30.84) v1(101.96,20.68) v1(101.96,15.6) v1(101.96,5.44) v1(107.04,56.24) v1(107.04,51.16) v1(107.04,46.08) v1(107.04,41) v1(107.04,35.92) v1(107.04,30.84) v1(107.04,15.6) v1(107.04,5.44) v1(112.12,56.24) v1(112.12,51.16) v1(112.12,46.08) v1(112.12,30.84) v1(112.12,15.6) v1(112.12,10.52) v1(112.12,5.44)
VCC5: length 94
  Top Layer w0.2: 59.97,24.55 60.12,24.55 v1(60.39,24.82) 60.31,24.9 ; U1.J2P56 U1.J2P54 ; U1.J2P56 U1.J2P58 ; U1.J2P56 59.91,25.3 ; U1.J2P54 60.39,25.7 ; U1.J2P54 U1.J2P52 ; 60.25,18.42 48.05,6.22 40.76,6.22 ; 59.92,26.11 60.05,26.11 60.36,25.8 ; U1.J2P58 U1.J2P60 ; U1.J2P58 60.31,24.9 ; 60.31,24.9 59.91,25.3 ; 59.91,25.3 59.99,25.3 60.39,25.7 ; 60.39,25.7 v1(60.41,25.72)
  Top Layer w0.3: 59.59,24.5 59.6,18.94 60.07,18.48
  Top Layer w0.4: R139.2 54.36,54.02 53.11,54.02 51.96,52.88 51.96,52.86 49.76,50.66
  Top Layer w1: 53.67,50.55 53.67,49.95 v1(54.18,49.45) ; 53.63,50.66 L9.2 ; C74.2 C73.2
  Bottom Layer w0.7: v1(60.39,24.82) 60.41,24.84 v1(60.41,25.72)
  Bottom Layer w1: v1(60.39,24.82) 59.71,25.5 ; 59.71,25.7 58.51,25.7 58.01,26.2 51.98,26.2 50.54,27.64 50.54,49.83 51.4,50.69 53.07,50.69 54.23,49.53
VCC12: length 19.1
  Top Layer w0.5: U63.2 49.91,55.8 49.65,56.05 v1(49.65,57.07) ; 52.2,55.29 U63.10 52.7,55.8 53.34,56.44 v2(53.34,57.39)
  Top Layer w1: D1.1 58.99,55.36 58.8,55.56 58.8,57.38 C71.1 58.48,57.45 58.42,57.39 v2(53.34,57.39)
  Bottom Layer w0.5: v2(53.34,57.39) 53.28,57.45 50.03,57.45 v1(49.65,57.07)
VDD_1V8: length 38
  Top Layer w0.2: 59.56,28.9 59.57,28.91 ; 59.56,28.49 59.56,28.72
  Top Layer w0.4: 59.52,28.76 58.49,28.76 57.96,28.23 57.96,19.88 56.5,18.42
  Top Layer w0.5: R146.1 44.3,18.42 44.3,17.32 45.21,16.41 R144.2 R147.1 50.15,14.37 55.02,14.37 56.29,15.64 56.29,18.36 1V8.1
VDD_2V5: length 10.4
  Top Layer w0.2: 58.28,18.44 58.28,18.53 58.48,18.73 58.48,27.55 58.65,27.72 59.17,27.72 ; 59.59,27.68 59.59,28.1 59.62,28.13
VDD_3V3: length 41.5
  Top Layer w0.2: 60.06,26.9 v1(60.44,27.27) 60.41,27.3 U1.J2P46 ; 3V3.1 61.22,19.2 61.22,26.21 60.9,26.52 v1(60.47,26.52) 60.44,26.5 U1.J2P50
  Top Layer w1: v1(52.71,48.14) 53.27,47.58 R141.1
  Bottom Layer w0.5: 60.47,27.24 v1(60.47,26.52)
  Bottom Layer w1: v1(60.44,27.27) 59.84,27.87 52.94,27.87 52.69,28.13 v1(52.69,47.44) 52.71,47.47 v1(52.71,48.14)
$2I6377\$1N450: length 1.6
  Top Layer w0.254: U63.5 50.8,53.44 C72.1
$2I6377\$1N552: length 12.2
  Top Layer w1: 69.48,46.86 69.03,46.86 68.11,45.94 62.69,45.94 61.82,46.81 61.82,50.62
$2I6377\BOOT: length 1.6
  Top Layer w0.254: U63.4 48.84,54.64
$2I6377\FEEDBACK: length 5.9
  Top Layer w0.254: R140.2 53.55,55.67 52.78,54.9 52.78,54.4 52.61,54.24 52.12,54.24 U63.7
  Top Layer w0.4: R139.1 54.49,55.65 R140.2
$2I6377\SW: length 8.2
  Top Layer w0.4: U63.12 51.3,55.39 51.05,55.14 U63.3 49.24,55.14 C75.2
  Top Layer w0.8: L9.1 44.94,55.74 C75.2
CFG_EXT: length 17.2
  Top Layer w0.2: 90.04,27.83 90.58,27.83 91.3,27.12 92.5,27.12 92.5,27.08 92.64,26.94 ; 104.56,25.05 104.56,23.43 104.62,23.36 ; 104.35,25.1 103.68,25.77 v1(103.6,25.77)
  Bottom Layer w0.2: 92.6,26.91 102.46,26.91 v1(103.6,25.77)
  vias: v1(92.6,26.85)
CFG_LDO0: length 43.5
  Top Layer w0.2: 107.4,25.16 106.71,25.85 v1(106.18,25.85) ; 93.21,27.65 91.39,27.65 90.83,28.21 90.03,28.21 90.02,28.2 ; 97.42,42.03 97.4,42.05 97.4,42.82 ; 107.55,25.13 107.55,23.28 107.66,23.17
  Bottom Layer w0.2: 106.24,25.88 104.54,27.58 93.21,27.58 ; 93.15,27.56 93.09,27.61 92.13,27.61 91.67,28.06 91.67,28.35 92.22,28.9 95.93,28.9 99.59,32.56 99.59,39.89 97.5,41.98 97.4,41.98
  vias: v1(93.17,27.62) v1(97.37,41.95)
CFG_LDO1: length 44.6
  Top Layer w0.2: v1(92.56,28.29) 91.37,28.29 91.03,28.62 90.01,28.62 ; 98.37,47.4 99,48.03 99,48.2 ; 110.34,25.34 110.24,25.24 109.36,25.24 109.29,25.3 109.29,25.78 ; 110.53,25.14 110.53,23.46 110.57,23.41
  Bottom Layer w0.2: 92.62,28.33 98.27,28.33 100.58,30.64 ; v1(98.37,47.4) 99.35,46.41 99.35,46.08 100.66,44.77 100.66,33.17 100.52,33.03 100.52,30.71 100.58,30.64 ; 109.31,25.84 106.85,28.3 102.92,28.3 100.58,30.64 ; 100.58,30.64 100.65,30.71
  vias: v1(109.27,25.82)
E1_AVDDL: length 32.7
  Top Layer w0.2: C9.2 89.16,34.06 v1(88.99,33.89) 88.44,33.34 88.44,31.66 ; C10.2 86.03,34.53 v1(86.03,33.86) 86.45,33.44 86.45,31.7 ; 90.04,30.21 91.53,30.21 91.78,30.46
  Top Layer w0.381: 100.72,28.86 100.73,28.87 100.73,30.75 98.68,32.8 C12.2 C11.2 96.36,32.84 v1(94.56,32.84)
  Bottom Layer w0.381: 91.8,30.45 92.86,31.5 92.86,34.39 86.55,34.39 v1(86.03,33.86) ; 92.86,34.27 92.97,34.39 93.78,34.39 94.56,33.6 v1(94.56,32.84)
  Bottom Layer w0.4: v1(88.99,33.89) 89.05,33.95 89.05,34.39
  vias: v1(91.82,30.47)
E1RX1+: length 15.5
  Top Layer w0.2: U7.4 88.04,37.46 89.92,39.34 89.92,40.86 89.78,41 89.41,41 89.27,41.14 89.27,41.5 89.41,41.64 89.56,41.64 89.67,41.75 89.67,45.58 RJ1.4
E1RX1-: length 12.3
  Top Layer w0.2: 87.64,31.79 87.64,38.41 v1(87.79,38.56) ; v1(85.93,40.32) 85.96,40.35 RJ1.7
  Bottom Layer w0.2: v1(85.93,40.32) 85.93,40.19 87.57,38.56 v1(87.79,38.56)
E1RX3+: length 15.5
  Top Layer w0.2: RJ1.8 84.69,39.79 85.38,39.1 85.38,38.46 85.24,38.32 84.97,38.32 84.57,37.93 84.57,34.27 84.71,34.13 84.97,34.13 86.04,33.06 U7.9
E1RX3-: length 15.5
  Top Layer w0.2: RJ1.9 83.42,41.24 84.05,40.62 83.76,40.33 83.47,40.33 83.19,40.05 83.19,39.85 83.44,39.59 83.83,39.59 84.21,39.21 84.21,39.06 83.94,38.79 83.33,38.79 83.19,38.65 83.19,38.45 83.95,37.69 83.95,37.18 83.46,36.69 83.2,36.69 83.06,36.54 83.06,36.29 83.95,35.4 83.95,34 85.64,32.32 U7.10
E1TX0+: length 15.5
  Top Layer w0.2: U7.1 89.24,32.43 92.21,35.4 92.21,38.45 92.65,38.89 92.31,39.23 RJ1.2
E1TX0-: length 15.5
  Top Layer w0.2: U7.2 88.84,32.8 91.51,35.46 91.51,35.91 91.33,36.09 90.5,36.09 90.3,36.29 90.3,36.67 90.48,36.85 91.32,36.85 91.38,36.91 91.38,37.15 91.2,37.33 90.66,37.33 90.48,37.5 90.48,37.76 90.66,37.94 90.88,37.94 91.08,38.13 91.08,38.72 91.04,38.75 RJ1.3
E1TX2+: length 15.5
  Top Layer w0.2: RJ1.5 88.54,43.12 88.54,41.39 88.4,41.25 87.95,41.25 87.94,41.26 87.8,41.12 87.8,40.5 87.94,40.35 88.14,40.35 88.16,40.37 89.29,40.37 89.43,40.23 89.43,39.73 89.29,39.59 87.38,39.59 87.24,39.45 87.24,38.79 87.24,38.79 87.24,38.33 87.24,38.32 U7.6
E1TX2-: length 15.5
  Top Layer w0.2: U7.7 86.84,40.35 87.24,40.35 87.32,40.43 87.32,40.8 87.25,40.86 86.64,40.86 86.44,41.06 87.32,41.94 87.32,45.61 RJ1.6
E2_AVDD33: length 37.7
  Top Layer w0.2: 24.89,32.04 24.87,32.04 24.61,32.3 ; 27.48,45.86 27.66,46.03
  Top Layer w0.4: C23.2 25.53,30.76 25.53,29.75 C24.2 ; 24.89,32.04 25.31,31.62 25.31,30.99 ; 19.44,32.23 19.44,31.53 C26.2 18.74,29.43 C25.2 18.32,29.02 v1(18.32,28.14) ; 27.66,46.03 27.66,46.84 ; 26.17,29.11 v1(26.17,28.29)
  Bottom Layer w0.4: v1(18.32,28.14) 19.44,27.02 24.9,27.02 v1(26.17,28.29) 25.53,28.92 25.53,43.58 27.61,45.65 27.61,45.9
  vias: v1(27.59,45.87)
E2_DVDD33: length 38.6
  Top Layer w0.2: R178.2 20.59,39.34 U10.29 ; 14.47,40.97 15.4,40.97 ; 14.47,40.97 14.47,40.65 ; 14.47,40.97 14.47,41.01 ; 14.47,40.97 11.69,40.97 ; 20.98,48.25 20.99,48.24
  Top Layer w0.4: 28.98,46.87 28.98,47.77 28.32,48.42 27.61,47.7 25.96,47.7 25.4,48.26 20.98,48.25 18.91,48.25
  Top Layer w0.7: 15.73,50.85 18.38,48.19
  Bottom Layer w0.2: v1(21.97,41.27) 15.13,41.27 v1(14.47,40.61)
  Bottom Layer w0.4: v1(22.1,47.9) 22.1,41.4 v1(21.97,41.27)
E2_DVDD_RGMII: length 39.8
  Top Layer w0.2: 21.11,50.67 21.19,50.59 21.19,49.86 ; 23.63,40.61 R178.1 20.99,38.23 U10.28 ; 23.63,40.61 v1(24.14,41.12) ; 23.63,40.61 25.39,40.61 R152.1 ; 36.8,48.07 36.68,47.95 33.15,47.95 31.62,47.97 30.49,46.85 30.49,43.16 29.63,42.29 28.76,42.29 ; 21.06,52.16 22.05,53.14 22.05,55.08 ; 27.2,42.28 28.71,42.28 ; 21.04,50.75 21.04,52.18
  Bottom Layer w0.2: v1(21.15,49.86) 23.49,47.53 23.49,41.64 23.63,41.5 23.75,41.5 v1(24.14,41.12)
E2_DVDDL: length 33.1
  Top Layer w0.2: 24.24,42.09 24.05,42.09 ; C31.2 25.32,36.65 v1(24.32,36.65)
  Top Layer w0.3: 23.79,36.65 24.25,36.65
  Top Layer w0.381: 24.24,42.09 24.66,42.09 v1(24.75,42) ; 8.36,30.47 8.36,28.07 9.79,26.64 ; 9.02,31.39 9.02,31.13 8.36,30.47
  Bottom Layer w0.381: v1(24.75,42) 24.88,41.87 24.88,36.89 24.68,36.69 24.33,36.69 ; 24.33,36.64 22.26,38.7 16.3,38.7 8.97,31.37
  vias: v1(8.96,31.41)
E2_LED0: length 10.9
  Top Layer w0.2: 15.49,42.51 15.53,42.46 16.51,42.46 17.24,41.73 17.24,38.35 18.83,36.75 18.83,35.68 18.98,35.54 19.34,35.54 19.35,35.53 19.4,35.53 ; 15.55,44.16 15.55,42.69
E2_LED1: length 36
  Top Layer w0.2: 13.51,44.28 13.51,42.54 ; 13.54,42.39 13.54,42.39 13.54,41.91 13.76,41.68 16.27,41.68 16.61,41.35 16.61,38.36 18.1,36.87 18.1,35.84 18.82,35.12 19.41,35.12 19.43,35.11 ; 11.48,17.43 11.48,16.38
  Bottom Layer w0.2: 17.98,36.37 18.09,36.26 18.09,35.31 17.62,34.83 17.62,23.66 11.48,17.52 11.45,17.52
  vias: v1(11.46,17.49) v1(18.12,36.34)
E2_LED2: length 44.2
  Top Layer w0.2: 11.68,42.48 11.67,42.47 ; 11.65,42.51 11.19,42.51 10.46,41.78 10.46,40.22 10.74,39.94 15.79,39.94 15.93,39.79 15.93,38.15 17.44,36.65 17.44,35.77 18.5,34.71 19.43,34.71 ; 11.74,44.42 11.74,42.55 ; 8.44,13.75 8.44,12.83 8.39,12.78
  Bottom Layer w0.2: 8.42,13.89 8.42,14.22 10.7,16.5 10.7,17.84 17.11,24.25 17.11,35.55 17.31,35.75
  vias: v1(8.45,13.79) v1(17.36,35.72)
E2_REG_O: length 3.2
  Top Layer w0.2: U10.30 20.19,37.31 20.07,37.42
  Top Layer w0.406: 20.07,37.42 20.07,38.57 L8.2
E2_RST: length 26.9
  Top Layer w0.2: 26.77,48.58 26.74,48.61 26.73,49.34 26.73,49.92 ; 27.23,52.17 27.23,51.91 26.73,51.41 26.73,49.97 26.67,49.91 ; 25.65,49.22 26.61,49.22 26.73,49.34 ; 24.54,32.71 25.54,32.71 v1(26.19,32.06)
  Bottom Layer w0.2: 25.73,49.24 26.2,49.24 28.94,46.51 28.94,43.13 26.1,40.29 26.1,32.16 v1(26.19,32.06)
  vias: v1(25.68,49.2)
E2_RXCLK: length 25.3
  Top Layer w0.2: 33.01,46.35 33.09,46.27 33.09,44.5 ; 21.37,36.65 21.37,36.66 21.39,36.68 21.39,38.04 22.77,39.42 26.86,39.42 26.87,39.41 27.33,39.41 27.35,39.42 34.03,39.42 35.63,37.82 R210.1 ; 32.94,44.36 31.83,44.36 31.57,44.1 31.57,39.47
E2_RXCTL: length 25
  Top Layer w0.2: U10.26 21.79,37.75 23.12,39.08 31.48,39.08 32.14,38.42 ; 34.76,44.36 34.68,44.43 34.15,44.43 ; 32.14,38.42 32.14,37.84 32.52,37.46 32.52,37.18 32.77,36.92 33.63,36.92 ; 32.14,38.42 32.36,38.64 v1(32.93,38.64) ; 35.03,44.22 34.87,44.37 34.87,46.44
  Bottom Layer w0.2: 34.18,44.43 34.18,39.9 v1(32.93,38.64)
  vias: v1(34.17,44.47)
E2_RXD0: length 22
  Top Layer w0.2: 30.67,38.01 29.98,38.7 23.37,38.7 22.2,37.53 22.2,36.7 ; 30.67,38.01 30.87,37.81 31.37,37.81 31.52,37.67 31.52,36.87 31.65,36.73 31.81,36.73 31.92,36.85 32.09,36.85 32.14,36.8 32.14,36.52 32.29,36.36 32.47,36.36 32.53,36.42 32.61,36.42 32.67,36.36 32.67,36.35 32.67,36.04 32.81,35.89 33.01,35.89 33.17,36.05 R208.1 ; 30.67,38.01 30.79,38.01 v1(31.06,38.27) ; 28.83,40.64 30.21,40.64 30.23,40.66
  Bottom Layer w0.2: v1(31.06,38.27) 31.06,39.97 30.3,40.72
  vias: v1(30.24,40.69)
E2_RXD1: length 19.9
  Top Layer w0.2: 26.99,40.75 27.07,40.67 27.07,40.04 ; R207.1 32.69,35.12 32.5,34.93 32.3,34.93 32.16,35.08 32.16,35.2 32.31,35.35 32.31,35.55 32.17,35.69 32.04,35.69 31.91,35.57 31.71,35.57 31.52,35.77 31.52,36.26 31.37,36.4 30.83,36.4 30.69,36.54 30.69,37.25 30.61,37.33 29.97,37.33 29.86,37.43 29.86,38.13 29.72,38.27 ; v1(29.47,37.94) 29.47,38.02 29.72,38.27 ; 29.72,38.27 23.43,38.27 22.59,37.43 U10.24
  Bottom Layer w0.2: 27.05,40.01 27.39,40.01 v1(29.47,37.94)
  vias: v1(27.1,39.97)
E2_RXD2: length 17.9
  Top Layer w0.2: R206.1 35.96,34.08 33.63,34.08 33.18,34.54 32.98,34.54 32.92,34.59 32.76,34.42 32.76,34.17 32.81,34.12 32.67,33.98 32.38,33.98 32.03,34.33 31.9,34.33 31.9,34.91 31.59,35.22 31.32,35.22 30.84,35.71 31.2,35.71 31.21,35.72 31.21,36 31.2,36.02 30.53,36.02 30.38,36.16 30.38,36.5 30.39,36.51 30.39,36.87 30.33,36.93 29.53,36.93 28.58,37.88 23.56,37.88 22.99,37.31 22.99,36.63 U10.23
E2_RXD3: length 30.5
  Top Layer w0.2: 36.07,44.43 36.74,44.43 36.75,44.44 ; 36.71,46.4 36.71,44.62 ; 33.61,33.11 33.2,33.52 v1(33.2,33.72) ; 33.61,33.11 R205.1 ; 33.61,33.11 32.57,33.11 31.7,33.98 31.4,33.98 31.37,34 31.37,34.84 31.29,34.92 31.2,34.92 31.16,34.96 31.08,34.96 30.74,34.61 30.63,34.72 30.63,35.45 30.59,35.5 30.25,35.16 30,35.4 30,36.23 29.89,36.35 29.77,36.35 29.68,36.26 29.68,36.03 29.62,35.96 29.42,35.96 29.22,36.16 29.22,36.47 28.15,37.53 23.78,37.53 23.39,37.14 U10.22
  Bottom Layer w0.2: v1(33.2,33.72) 36.05,36.57 36.05,44.51
  vias: v1(36.02,44.44)
E2_TXCLK: length 17.5
  Top Layer w0.2: U10.20 28.79,35.93 32.62,32.1 32.82,32.1 32.96,32.24 32.92,32.28 32.92,32.56 33.01,32.65 33.14,32.65 33.25,32.53 33.25,32.04 33.5,31.79 33.53,31.79 33.67,31.93 33.67,32.51 33.75,32.58 33.86,32.58 34.04,32.4 34.04,31.82 34.16,31.71 34.3,31.85 34.3,32.3 34.55,32.56 34.65,32.56 34.73,32.48 34.73,31.82 34.91,31.64 35.06,31.64 35.18,31.76 35.18,32.1 35.29,32.21 35.45,32.21 35.59,32.07 36.06,32.07
E2_TXCTL: length 10.9
  Top Layer w0.2: 33.66,31.14 33.67,31.13 ; R188.1 32.97,31.1 28.55,35.51 24.59,35.51
E2_TXD0: length 17
  Top Layer w0.2: U10.18 28.22,35.13 33.23,30.12 33.43,30.12 33.65,30.34 33.79,30.19 33.79,29.91 33.82,29.88 34.11,29.88 34.11,30.14 34.2,30.24 34.3,30.24 34.4,30.14 34.4,29.97 34.5,29.86 34.54,29.86 34.74,30.06 34.74,30.41 35.05,30.41 35.05,29.66 35.22,29.66 35.36,29.8 35.36,30.47 35.47,30.58 35.57,30.58 35.64,30.5 35.64,30.17 35.65,30.16 36.07,30.16
E2_TXD1: length 11.7
  Top Layer w0.2: U10.17 27.8,34.73 33.08,29.46 33.08,29.1 33.08,29.11 R190.1
E2_TXD2: length 14.2
  Top Layer w0.2: R192.1 36.18,28.19 33.38,28.19 27.24,34.33 U10.16
E2_TXD3: length 12.3
  Top Layer w0.2: U10.15 26.88,33.93 33.53,27.27 R193.1
E2_XTAL_I: length 9.2
  Top Layer w0.2: 19.65,33.56 19.62,33.54 13.56,33.54 12.81,34.29 12.81,34.32 ; 10.96,34.53 10.98,34.5 12.94,34.5
E2_XTAL_O: length 7.3
  Top Layer w0.2: 14.9,36.02 14.93,36 15.16,36 17.22,33.93 19.32,33.93 19.34,33.95 ; 14.79,38.05 14.79,36.33 14.98,36.15
E2RX1+: length 19.1
  Top Layer w0.2: U10.4 21.39,24.53 18.55,21.69 18.55,21.49 19.21,20.83 19.21,20.29 19.2,20.27 19.2,20.15 18.93,19.88 18.93,19.4 19.06,19.27 19.06,14.36 RJ5.4
E2RX1-: length 15.9
  Top Layer w0.2: RJ5.7 22.7,20.82 v1(22.1,21.41) ; v1(21.48,23.77) 21.8,24.1 21.8,31.55
  Bottom Layer w0.2: v1(21.48,23.77) 21.67,23.77 22.48,22.95 22.48,21.79 v1(22.1,21.41)
E2RX3+: length 19.1
  Top Layer w0.2: U10.9 23.39,30.43 24.26,29.56 24.26,28.92 24.52,28.67 24.52,25.5 23.25,24.22 23.25,23.72 23.43,23.54 23.68,23.54 23.75,23.46 23.75,22.57 24.26,22.07 24.26,21.43 24.01,21.18 24.01,14.23 RJ5.8
E2RX3-: length 19.1
  Top Layer w0.2: RJ5.9 25.24,21.47 24.77,21.94 24.77,22.07 24.75,22.08 25.02,22.36 25.5,22.36 25.53,22.39 25.66,22.39 25.91,22.65 25.91,22.77 25.66,23.02 25.22,23.02 24.84,23.39 24.84,23.65 25.02,23.83 25.66,23.83 25.84,24.01 26.17,24.01 26.17,24.22 25.84,24.55 25.2,24.55 25.02,24.73 25.02,28.92 24.77,29.18 24.77,29.81 23.79,30.8 U10.10
E2TX0+: length 19.1
  Top Layer w0.2: 20.18,31.62 20.17,31.61 20.17,29.16 16.38,25.37 16.38,14.19 16.32,14.12
E2TX0-: length 19.1
  Top Layer w0.2: U10.2 20.59,28.93 17.28,25.62 17.28,24.48 17.66,24.1 18.04,24.1 18.18,23.96 18.18,23.72 18.04,23.58 17.53,23.58 17.22,23.27 17.22,23.07 17.43,22.86 17.91,22.86 17.91,22.84 18.05,22.7 18.05,22.45 17.92,22.31 17.4,22.31 17.4,22.2 17.4,22.19 17.4,22.07 17.66,21.81 17.66,21.43 17.4,21.18 17.4,20.92 17.66,20.67 17.66,16.77 RJ5.3
E2TX2+: length 19.1
  Top Layer w0.2: U10.6 22.19,23.69 21.71,23.21 20.97,23.21 19.69,21.94 19.69,21.18 19.7,21.16 20.34,21.16 20.71,20.8 20.71,20.29 20.33,19.91 19.82,19.91 19.68,19.77 19.68,19.57 20.1,19.14 20.44,19.14 20.71,18.88 20.71,18.84 20.38,18.51 20.2,18.51 19.94,18.26 19.94,18 20.06,18 20.2,17.86 20.2,16.77 RJ5.5
E2TX2-: length 19.1
  Top Layer w0.2: U10.7 22.59,23.44 21.34,22.19 21.34,20.92 22.1,20.16 22.1,20.1 21.77,19.77 21.36,19.77 21.21,19.62 21.21,19.28 21.47,19.03 21.47,19.02 21.6,18.89 21.6,18.54 21.52,18.46 21.52,14.28 RJ5.6
ETH1_MDC: length 73.6
  Top Layer w0.2: 41.43,24.84 41.56,24.84 41.87,25.12 ; 41.87,25.12 42.47,25.71 45.56,25.71 ; 41.87,25.12 41.84,25.09 ; 84.82,30.2 83.91,30.2 82.7,31.42 ; 24.54,33.14 26.13,33.14 33.66,25.6 36.28,25.6 36.28,24.85 v1(36.32,24.81)
  Bottom Layer w0.2: 82.59,31.46 82.27,31.15 80.78,31.15 77.31,27.67 70.16,27.67 69.2,26.71 69.2,24.82 68.49,24.12 59.26,24.12 58.48,24.91 41.41,24.91 ; 36.28,24.88 36.31,24.85 41.41,24.85
  vias: v1(41.4,24.79) v1(82.62,31.38)
ETH1_MDIO: length 79.3
  Top Layer w0.2: 84.9,29.79 84.88,29.81 83.4,29.81 82.65,30.55 82.63,30.55 ; 24.45,33.53 26.44,33.53 33.72,26.25 35.43,26.25 35.84,26.67 41.53,26.67 41.73,26.47 41.73,26.19 ; 41.73,26.19 41.29,26.19 40.65,25.54 40.65,24.06 40.95,23.76 42.18,23.76 42.19,23.77 42.76,23.77 ; 41.73,26.19 41.82,26.09 ; 67.98,22.66 67.98,21.61 68,21.59 ; 41.9,26.1 41.94,26.13 45.54,26.13
  Bottom Layer w0.2: 82.63,30.66 81.79,30.66 77.98,26.85 70.49,26.85 70.15,26.51 70.15,23.87 70,23.73 69.8,23.73 69.79,23.74 42.9,23.74 ; 66.59,23.74 67.61,22.72 v1(67.95,22.72)
  vias: v1(42.89,23.72) v1(82.61,30.5)
ETH1_RST: length 26.6
  Top Layer w0.2: v1(83.92,31.16) 84.27,30.81 84.29,30.81 84.48,30.62 84.9,30.62 ; 81.23,15.53 80.28,16.48 v1(80.28,17.73) 81.2,17.73 R8.1 ; 81.14,15.25 81.14,13.71 83.14,11.71 85.34,11.71
  Bottom Layer w0.2: v1(83.92,31.16) 83.54,30.78 83.54,26.3 83.95,25.89 83.95,25.63 83.54,25.22 83.54,21.65 80.28,18.39 v1(80.28,17.73)
ETH1_RXCLK: length 27.5
  Top Layer w0.2: 84.49,17.38 84.55,17.45 84.55,17.68 ; 81.27,24.33 87.38,24.33 88.04,24.98 U7.27 ; 81.27,24.33 81.25,24.31 v1(81.25,23.72) ; 81.27,24.33 79.76,24.33 79.2,24.89 76.46,24.89 75.72,25.62 R198.1 ; 84.55,17.68 84.58,17.7 ; 84.55,17.68 84.55,19.78 84.19,20.14 81.23,20.14 ; 81.23,20.14 81.29,20.19 81.29,20.54 ; 81.23,20.14 80.15,20.14
  Bottom Layer w0.2: v1(81.25,23.72) v1(81.25,20.61)
ETH1_RXCTL: length 51.5
  Top Layer w0.2: 69.36,4.5 70.34,5.49 70.34,14.12 69.75,14.71 69.75,21.25 70.27,21.78 72.03,21.78 ; 72.01,26.61 73.77,26.61 74.03,26.87 74.63,26.87 74.63,26.61 74.78,26.46 74.94,26.46 75.04,26.56 75.04,26.69 75.29,26.94 75.47,26.94 75.54,26.87 75.54,26.56 75.69,26.42 75.78,26.42 75.96,26.6 75.96,26.72 76.1,26.87 76.34,26.87 77.9,25.31 81,25.31 81.59,24.71 87.21,24.71 87.66,25.17 87.66,25.28 87.67,25.29 87.67,25.81 87.64,25.85 U7.26 ; 72.03,21.78 72.03,21.76 ; 72.03,21.78 78.76,21.78 78.78,21.76 ; 72.03,21.78 72.03,22.78 72.01,22.8 ; R197.1 71.99,26.07 v1(71.96,26.04)
  Bottom Layer w0.2: 71.91,26.09 71.91,22.79 72.06,22.63
  vias: v1(71.98,22.68)
ETH1_RXD0: length 18.5
  Top Layer w0.2: 74.26,27.63 76.36,27.63 78.33,25.67 81.12,25.67 81.13,25.66 81.78,25.66 82.36,25.09 86.49,25.09 87.23,25.83 87.23,26.71 U7.25
  Bottom Layer w0.2: v1(87.01,25.32) 86.36,25.32 v1(84.48,23.44)
ETH1_RXD1: length 19.5
  Top Layer w0.2: R195.1 76.36,28.54 78.85,26.05 83,26.05 83.66,25.39 86.26,25.39 86.56,25.69 86.56,25.75 86.84,26.03 U7.24
  Bottom Layer w0.2: v1(82.77,23.46) 82.81,23.5 v1(82.81,25.75)
ETH1_RXD2: length 14.6
  Top Layer w0.2: U7.23 86.44,26.08 86.22,25.86 86.19,25.86 86.1,25.76 84.5,25.76 84.41,25.86 84.17,25.86 83.65,26.39 79.65,26.39 76.44,29.59 74.26,29.59 74.25,29.61
ETH1_RXD3: length 45.6
  Top Layer w0.2: 69.15,7.4 69.19,7.44 69.19,22.5 70.09,23.4 78.92,23.4 78.99,23.33 ; R181.1 76.43,30.53 80.1,26.86 83.95,26.86 84.32,26.5 84.32,26.49 84.64,26.16 84.65,26.16 84.71,26.11 85.39,26.11 85.44,26.07 85.84,26.07 85.89,26.11 86.02,26.11 86.04,26.13 U7.22
  Bottom Layer w0.2: 78.76,23.92 79.92,25.08 v1(79.92,27.12)
  vias: v1(78.76,23.99)
ETH1_TXCLK: length 12.4
  Top Layer w0.2: R204.1 76.54,31.52 80.65,27.4 84.36,27.4 84.38,27.42 U7.20
ETH1_TXCTL: length 20.4
  Top Layer w0.2: R203.1 72.39,32.5 72.6,32.71 72.6,32.81 72.7,32.91 72.83,32.91 72.93,32.81 72.93,32.51 73.04,32.39 73.21,32.39 73.29,32.47 73.29,32.75 73.4,32.86 73.51,32.86 73.62,32.76 73.62,32.45 73.84,32.23 73.97,32.23 74.06,32.31 74.06,32.81 74.17,32.92 74.33,32.92 74.43,32.81 74.43,32.25 74.58,32.1 74.68,32.1 74.81,32.23 74.81,32.75 74.92,32.86 75.09,32.86 75.24,32.71 75.24,32.12 75.34,32.02 75.49,32.02 75.62,32.15 75.62,32.63 75.85,32.86 76.03,32.68 76.03,32.12 76.23,31.92 76.59,32.28 81.03,27.83 84.18,27.83 84.2,27.82 U7.19 ; 71.91,32.5 71.89,32.52
ETH1_TXD0: length 12.9
  Top Layer w0.2: U7.18 81.56,28.22 81.56,28.21 76.29,33.48 74.22,33.48
ETH1_TXD1: length 15.4
  Top Layer w0.2: U7.17 81.95,28.62 76.1,34.46 72.01,34.46
ETH1_TXD2: length 13.4
  Top Layer w0.2: U7.16 84.94,29.01 82.65,29.01 76.19,35.46 74.19,35.46
ETH1_TXD3: length 15.9
  Top Layer w0.2: U7.15 82.92,29.42 82.91,29.4 75.84,36.47 72.01,36.47 72,36.46
ETH1_XTAL_I: length 8.2
  Top Layer w0.2: 95.14,27.33 95.14,25.47 95.26,25.34 ; 89.89,29.43 89.9,29.42 92.41,29.42 93.97,27.86 93.97,27.55 94.11,27.41 95.01,27.41
ETH1_XTAL_O: length 9.5
  Top Layer w0.2: 97.03,28.93 97.03,28.96 96.18,29.81 89.9,29.81 89.9,29.82 ; 98.94,28.88 98.85,28.79 97.03,28.79
JTAG_TCK: length 43.9
  Top Layer w0.2: 62.64,32.1 64.37,32.1 65.73,30.74 65.73,12.5 63.43,10.2 ; 59.4,10.04 59.4,7.67 59.32,7.59 ; 53.5,4.88 53.5,8.22 57.3,12.01 58.38,12.01 59.32,11.07 59.32,10.01
  Bottom Layer w0.2: 59.33,10.03 63.22,10.03 63.36,10.17
  vias: v1(59.34,10.06) v1(63.41,10.18)
JTAG_TDI: length 24.4
  Top Layer w0.2: 62.75,30.89 63.37,30.89 63.61,30.64 63.61,14.77 61.79,12.95 61.79,7.97
JTAG_TDO: length 27.6
  Top Layer w0.2: v1(62.63,12.44) 64.2,14.01 64.2,30.79 63.69,31.31 62.6,31.31 ; 60.76,12.37 60.66,12.27 60.66,7.71
  Bottom Layer w0.2: 60.72,12.36 62.59,12.36 62.72,12.49
  vias: v1(60.7,12.38)
JTAG_TMS: length 31
  Top Layer w0.2: 62.65,31.7 63.92,31.7 65.06,30.56 65.06,13.45 62.69,11.08 ; 58.08,11.04 58.08,8.08 58.03,8.03
  Bottom Layer w0.2: 57.98,11.06 58.03,11.01 62.56,11.01
  vias: v1(58.03,10.96) v1(62.61,10.98)
PMOD3V3: length 184.9
  Top Layer w0.3: 2.86,22.09 4.08,22.09 4.1,22.07 4.1,20.58 4.5,20.18 5.2,20.18 5.27,20.25
  Top Layer w0.4: 103.88,10.34 103.93,10.39 103.93,10.44 103.89,10.48 102.6,10.48 102.46,10.62 102.46,10.65 101.6,11.51 101.6,11.86 101.32,12.15 101.32,12.41 101.27,12.46
  Top Layer w0.5: 102.03,14.23 101.2,13.41 101.2,12.41 101.15,12.36 ; 3.58,23.92 2.96,23.3 2.96,22.1
  Top Layer w0.7: 100.53,14.39 100.61,14.3 101.94,14.3 ; 100.53,22.56 100.08,23.01 95.87,23.01 95.43,22.56 ; 55.56,47.47 55.67,47.37 55.67,46.32 55.06,45.71 52.33,45.71 50.24,47.8 41.59,47.8 38.34,51.04 38.34,56.93 37.32,57.96 17.4,57.96 17.26,57.82 17.26,53.3 16.14,52.19 15.99,52.19 15.89,52.29 ; 15.92,52.39 13.7,52.39 11.41,50.1 6,50.1 3.3,47.4 3.3,24.66 3.8,24.16 ; 55.73,47.63 55.89,47.8
  Top Layer w1: 95.49,22.52 96.3,21.7 96.3,21.49 ; 55.81,47.56 55.82,47.55 v1(58.06,47.55)
  Bottom Layer w0.7: 100.43,14.52 100.48,14.57 100.48,22.58 ; v1(58.06,47.55) 60.55,45.05 76.41,45.05 86.01,35.45 95,35.45 95.97,34.49 95.97,31.9 93.68,29.61 91.5,29.61 90.73,28.85 90.73,27.3 v1(95.49,22.55)
  vias: v1(100.51,22.62) v1(100.48,14.4)
REG_O: length 2.9
  Top Layer w0.508: 89.41,26.77 89.42,26.77 91.45,24.74
$1N6065: length 11
  Top Layer w0.2: 44.58,44.15 44.49,44.15 44.47,44.14 44.47,42.29 49.42,37.34 49.42,35.95 49.4,35.93 49.4,35.87 49.24,35.72 48.9,35.72
$1N6068: length 11.3
  Top Layer w0.2: 48.87,35.31 49.31,35.31 49.78,35.78 49.78,37.86 45.53,42.11 45.53,44.04 45.64,44.15
$1N6071: length 11.7
  Top Layer w0.2: 48.84,34.93 49.34,34.93 49.39,34.98 49.44,34.98 50.15,35.69 50.15,35.74 50.23,35.82 50.23,38.54 46.53,42.23 46.53,43.85 46.79,44.11
$1N6074: length 12
  Top Layer w0.2: 48.04,44.21 48.03,44.21 48.03,41.86 50.66,39.24 50.66,35.63 49.54,34.52 48.83,34.52 48.81,34.5
$1N6077: length 12.4
  Top Layer w0.2: 49.13,44.18 49.14,44.17 49.14,42.13 51.06,40.22 51.06,35.5 49.68,34.12 48.76,34.12 48.76,34.13
$1N6080: length 12.8
  Top Layer w0.2: 48.7,33.71 49.86,33.71 51.48,35.33 51.48,40.64 50.19,41.94 50.19,44.08 50.24,44.13
$1N6471: length 3.4
  Top Layer w0.2: 45.51,30.52 43.26,30.52 43.19,30.58 L6.1
$1N6999: length 19.1
  Top Layer w0.2: 59.61,30.51 59.58,30.51 59.58,30.51 57.01,30.51 55.9,29.4 55.9,22.48 50.75,17.34 50.75,16.6
$1N7020: length 18.1
  Top Layer w0.2: 52.07,16.53 52.07,17.83 56.4,22.16 56.4,29.21 57.3,30.11 59.6,30.11 59.61,30.1
$1N7041: length 16.8
  Top Layer w0.2: 53.42,16.61 53.4,16.62 53.4,18.28 56.86,21.74 56.86,29.02 57.55,29.71 59.48,29.71 59.48,29.71
$1N7062: length 15.6
  Top Layer w0.2: 54.58,16.58 54.58,18.62 57.35,21.39 57.35,28.66 58.02,29.33 59.49,29.33
$1N7116: length 9.3
  Top Layer w0.2: 45.38,35.71 41.88,35.71 39.78,37.81 36.93,37.81 R210.2
